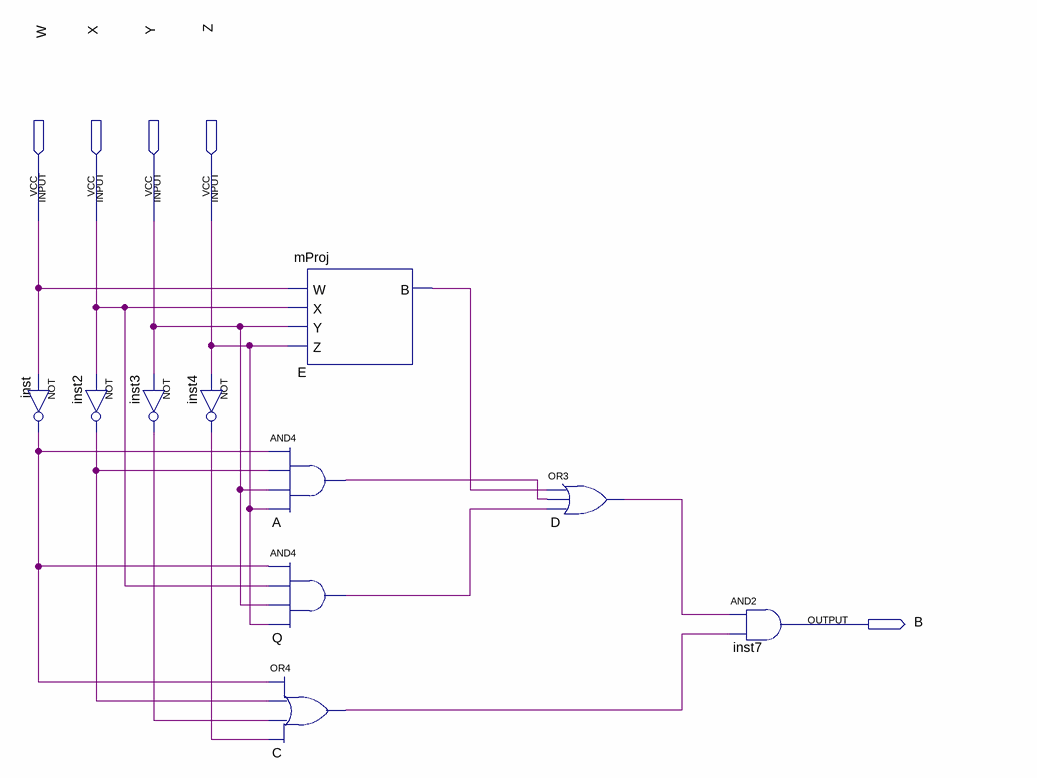
[diagram p0: schematic sheet]
// Quartus schematic mProj_step3.bdf as structural Verilog: 10 symbols, 5 pins
module mProj_step3 (
  input  W,
  input  X,
  input  Y,
  input  Z,
  output B
);

  wire A_out, C_out, D_out, E_b, inst2_out, inst3_out, inst4_out, inst_out, Q_out;

  not inst (inst_out, W);
  not inst2 (inst2_out, X);
  not inst3 (inst3_out, Y);
  not inst4 (inst4_out, Z);
  and A (A_out, inst_out, inst2_out, Y, Z);
  and Q (Q_out, inst_out, X, Y, Z);
  or C (C_out, inst_out, inst2_out, inst3_out, inst4_out);
  mProj E (.W(W), .X(X), .Y(Y), .Z(Z), .B(E_b));
  or D (D_out, E_b, A_out, Q_out);
  and inst7 (B, D_out, C_out);
endmodule
